# Altium schematic sheet Panel protection.SchDoc
size A4; SheetNumber: 2; SheetTotal: 4
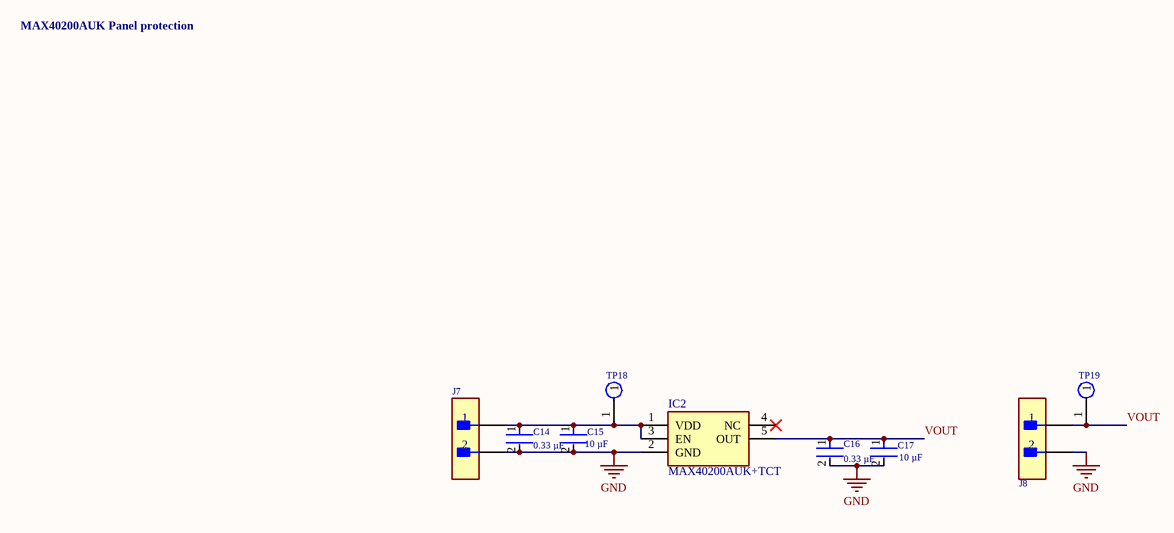
[diagram p0: Panel protection.SchDoc]

## Parts
C14  0.33 µF  [FP-CC0603-DA-MFG]
C15  10 µF  [1206]
C16  0.33 µF  [FP-CC0603-DA-MFG]
C17  10 µF  [1206]
IC2  MAX40200AUK+TCT  [SOT95P280X145-5N]
J7  B2B-XH-A(LF)(SN)  [FP-B2B-XH-A_LF_SN-MFG]  (value not drawn)
J8  B2B-XH-A(LF)(SN)  [FP-B2B-XH-A_LF_SN-MFG]  (value not drawn)
TP18  S2761-46R  [S276146R]  (value not drawn)
TP19  S2761-46R  [S276146R]  (value not drawn)

## Nets
GND: C14.2 C15.2 C16.2 C17.2 IC2.2(GND) J7.2 J8.2
VOUT: C16.1 C17.1 IC2.5(OUT) J8.1 TP19.1
NetC14_1: C14.1 C15.1 IC2.1(VDD) IC2.3(EN) J7.1 TP18.1

Not connected (* = marked no-connect by the designer): IC2 4(NC)*

## Notes on the sheet
- MAX40200AUK Panel protection

## Library data of the parts
C14 C16 = CMP-03422-000838-1: CAP CER 0.33UF 16V X7R 0603CC0603KRX7R7BB334; Manufacturer: YAGEO; Value: 330 nF; Material: Ceramic; Tolerance: 0.1; Description: CC0603 330 nF X7R 10.00% 16 V; Temperature Coefficient: 15%; Package: CC0603-DA; Footprint Url: http://www.yageo.com/exep/pages/download/literatures/UPY-C_GEN_24.pdf; Lead Free: Yes; Temperature: -55°C to +125°C; RoHS: TRUE; Temperature Range High: +125°C; Mouser Description: Multilayer Ceramic Capacitors MLCC - SMD/SMT 330nF 16V X7R 10%; Category: Cap; Temperature Characteristic: X7R; Octopart: https://octopart.com/cc0603krx7r7bb334-yageo-9291796; Voltage: 16 V; Device Class L1: Passive Components; Capacitance: 330 nF; ComponentLink2URL: http://www.yageo.com/documents/recent/UPY-GPHC_X7R_6.3V-to-50V_18.pdf; Temperature Range Low: -55°C; Digikey Description: CAP CER 0.33UF 16V X7R 0603; Manufacturer Part Number: CC0603KRX7R7BB334; Device Class L2: Capacitors; Voltage Rating: 16 V; Device Class L3: Ceramic Capacitors; ComponentLink2Description: Datasheet; Height: 0.9mm; Automotive: No
C15 C17 = CC1206KKX5R7BB106: CC1206KKX5R7BB106 10 µF ±10% 16V Ceramic Capacitor X5R 1206 (3216 Metric); Manufacturer Part Number: C0603C223K4RACTU; Manufacturer: KEMET; Capacitance: 22,000 pF; Temperature Characteristic: X7R; Temperature Coefficient: 30ppm/°C; Automotive Grade: Grade 1; Value: 22,000 pF; Tolerance: 0.1; Category: Cap; RoHS: TRUE; Temperature Range High: +125°C; Octopart: https://octopart.com/c0603c223k4ractu-kemet-123286; Mouser Description: CAP CER 0.022UF 16V X7R 0603; Voltage Rating: 16 V; Device Class L1: Passive Components; Automotive: Yes; Height: 0.87mm; Device Class L3: Ceramic Capacitors; Package: C0603C-CF; Device Class L2: Capacitors; Material: Ceramic; Lead Free: Yes; ComponentLink2URL: https://api.kemet.com/component-edge/download/datasheet/C0603C100J5GACAUTO.pdf; Temperature Range Low: -55°C; Digikey Description: Ceramic Capacitor 0.022Uf 16V, X7R, 10%, 0603, Full Reel; Temperature: -55°C to +125°C; ComponentLink2Description: Datasheet
IC2 = MAX40200AUK+TCT: Integrated Circuit; Manufacturer_Name: Analog Devices; Height: 1.45mm; Manufacturer_Part_Number: MAX40200AUK+TCT
J7 J8 = CMP-2000-05888-3: CONN HEADER VERT 2POS 2.5MM; Current Rating: 3A; Voltage Rating: 250V; Number of Contacts: 2; Contact Resistance: 20mR; Wire/Cable Gauge: 22AWG; Insulation Resistance: 1GR; Connector Type: Male Pin; Packaging: Bulk; Contact Material: Brass; Lead Free: Lead Free; Orientation: Straight; Contact Plating: Tin; Max Current Rating: 3A; Termination: Solder; Fastening Type: Detent; Depth: 5.75mm; Housing Material: Polyamide; REACH SVHC: No SVHC; Series: XH; Voltage Rating (AC): 250V; Number of Positions: 2; Color: Natural; Contact Type: Male Pin; Max Voltage Rating (DC): 250V; Pitch: 2.5mm; Lead Pitch: 2.5mm; Mount: Through Hole; Max Operating Temperature: 85°C; Length: 7.4mm; Max Voltage Rating (AC): 250V; Min Operating Temperature: -25°C; Number of Rows: 1; Housing Color: White
TP18 TP19 = S2761-46R: Test Point; Manufacturer_Name: Harwin; Datasheet Link: https://www.mouser.fr/ProductDetail/Harwin/S2761-46R?qs=DaxoyN%2FvrebHvZaagZ7Fog%3D%3D; Height: 1.15mm; Manufacturer_Part_Number: S2761-46R; Mouser Part Number: 855-S2761-46R; Mouser Price/Stock: https://www.mouser.co.uk/ProductDetail/Harwin/S2761-46R?qs=DaxoyN%2FvrebHvZaagZ7Fog%3D%3D